# EAGLE design joystick (EAGLE 7.5.0)
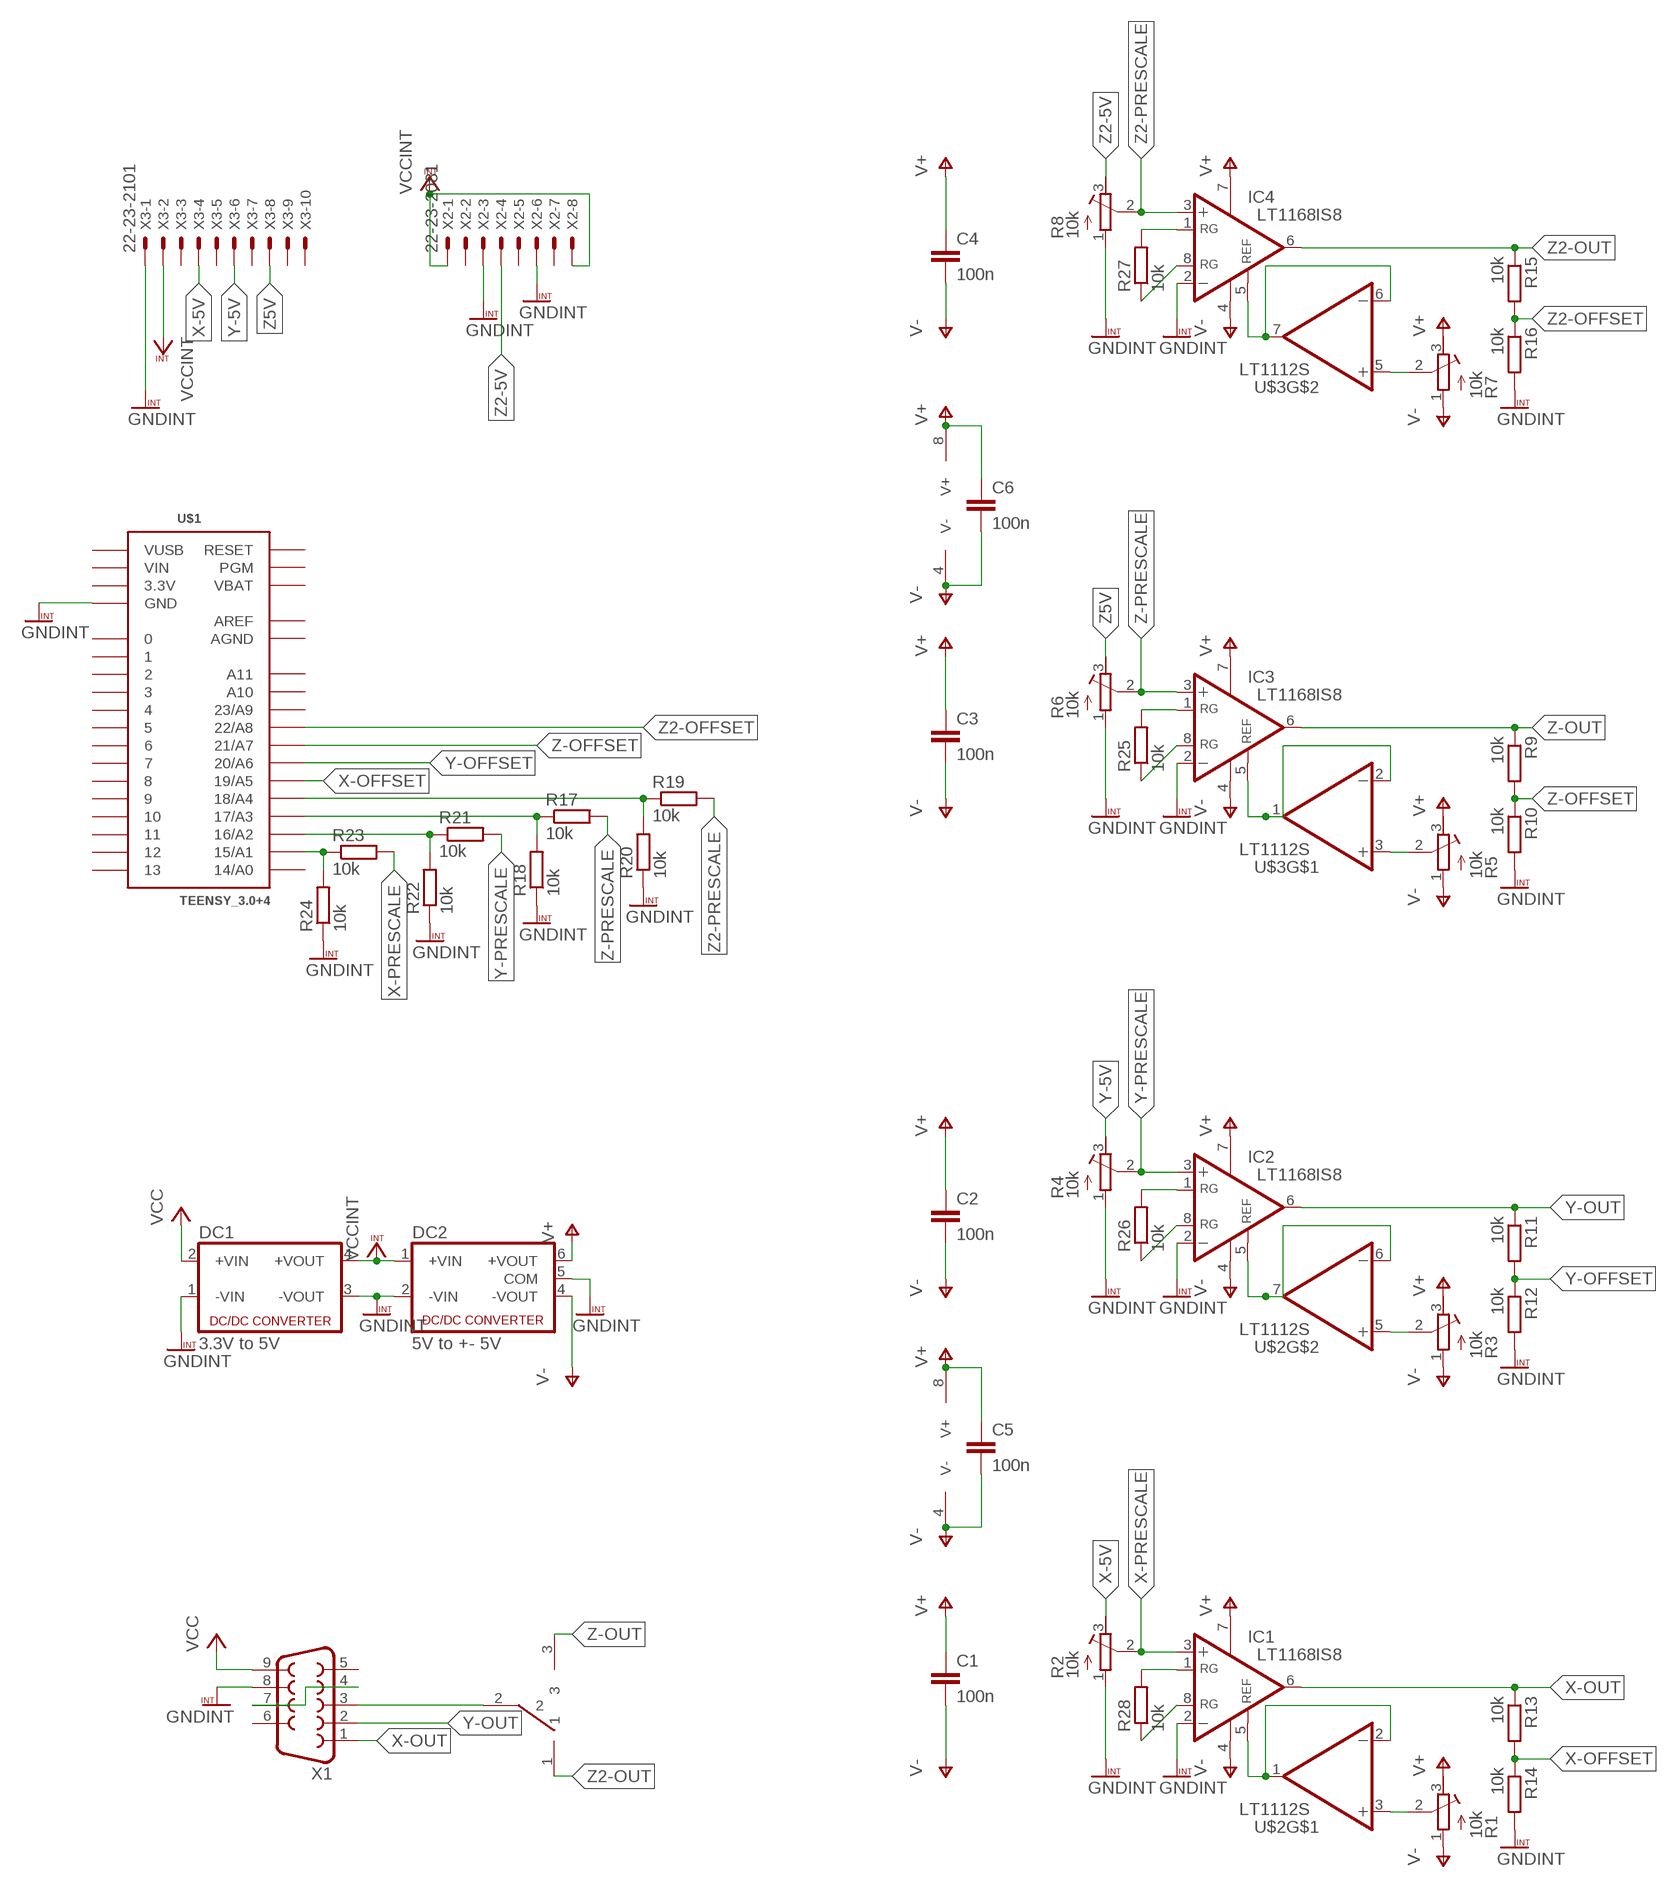
[diagram p0: schematic, sheet 1]

## Parts
C1  100n  C-EUC1206  [C1206]
C2  100n  C-EUC1206  [C1206]
C3  100n  C-EUC1206  [C1206]
C4  100n  C-EUC1206  [C1206]
C5  100n  C-EUC1206  [C1206]
C6  100n  C-EUC1206  [C1206]
DC1  3.3V to 5V  NME  [NME]
DC2  5V to +- 5V  NMA  [NMA]
IC1  LT1168IS8  [SOIC8]
IC2  LT1168IS8  [SOIC8]
IC3  LT1168IS8  [SOIC8]
IC4  LT1168IS8  [SOIC8]
R1  10k  R-TRIMM64W  [RTRIM64W]
R2  10k  R-TRIMM64W  [RTRIM64W]
R3  10k  R-TRIMM64W  [RTRIM64W]
R4  10k  R-TRIMM64W  [RTRIM64W]
R5  10k  R-TRIMM64W  [RTRIM64W]
R6  10k  R-TRIMM64W  [RTRIM64W]
R7  10k  R-TRIMM64W  [RTRIM64W]
R8  10k  R-TRIMM64W  [RTRIM64W]
R9  10k  R-EU_R1206  [R1206]
R10  10k  R-EU_R1206  [R1206]
R11  10k  R-EU_R1206  [R1206]
R12  10k  R-EU_R1206  [R1206]
R13  10k  R-EU_R1206  [R1206]
R14  10k  R-EU_R1206  [R1206]
R15  10k  R-EU_R1206  [R1206]
R16  10k  R-EU_R1206  [R1206]
R17  10k  R-EU_R1206  [R1206]
R18  10k  R-EU_R1206  [R1206]
R19  10k  R-EU_R1206  [R1206]
R20  10k  R-EU_R1206  [R1206]
R21  10k  R-EU_R1206  [R1206]
R22  10k  R-EU_R1206  [R1206]
R23  10k  R-EU_R1206  [R1206]
R24  10k  R-EU_R1206  [R1206]
R25  10k  R-EU_R1206  [R1206]
R26  10k  R-EU_R1206  [R1206]
R27  10k  R-EU_R1206  [R1206]
R28  10k  R-EU_R1206  [R1206]
U$1  TEENSY_3.0+4  [TEENSY_3.0+4]
U$2  LT1112S  [SOIC8]
U$3  LT1112S  [SOIC8]
U$4  MS12ASG40  [MS12ASG40]
X1  F09HP  [F09HP]
X2  22-23-2081  [22-23-2081]
X3  22-23-2101  [22-23-2101]

## Nets
GNDINT: DC1.1(-VIN) DC1.3(-VOUT) DC2.2(-VIN) DC2.5(COM) IC1.2(-IN) IC2.2(-IN) IC3.2(-IN) IC4.2(-IN) R2.1(A) R4.1(A) R6.1(A) R8.1(A) R10.2 R12.2 R14.2 R16.2 R18.1 R20.1 R22.1 R24.1 U$1.GND U$1.GND1(GND) X1.8 X2.3 X2.6 X3.1
N$1: R1.2(S) U$2.3(+IN)
N$4: R3.2(S) U$2.5(+IN)
N$7: R5.2(S) U$3.3(+IN)
N$10: R7.2(S) U$3.5(+IN)
N$13: IC1.5(REF) U$2.1(OUT) U$2.2(-IN)
N$14: IC2.5(REF) U$2.6(-IN) U$2.7(OUT)
N$15: IC3.5(REF) U$3.1(OUT) U$3.2(-IN)
N$16: IC4.5(REF) U$3.6(-IN) U$3.7(OUT)
N$20: X1.4 X1.7
N$26: U$4.2 X1.3
N$27: R17.1 R18.2 U$1.17/A3
N$28: R19.1 R20.2 U$1.18/A4
N$29: R21.1 R22.2 U$1.16/A2
N$30: R23.1 R24.2 U$1.15/A1
N$32: IC1.8(RG) R28.1
N$33: IC1.1(RG) R28.2
N$34: IC2.1(RG) R26.2
N$35: IC2.8(RG) R26.1
N$36: IC3.1(RG) R25.2
N$37: IC3.8(RG) R25.1
N$38: IC4.8(RG) R27.1
N$39: IC4.1(RG) R27.2
V+: C1.1 C2.1 C3.1 C4.1 C5.1 C6.1 DC2.6(+VOUT) IC1.7(V+) IC2.7(V+) IC3.7(V+) IC4.7(V+) R1.3(E) R3.3(E) R5.3(E) R7.3(E) U$2.8(V+) U$3.8(V+)
V-: C1.2 C2.2 C3.2 C4.2 C5.2 C6.2 DC2.4(-VOUT) IC1.4(V-) IC2.4(V-) IC3.4(V-) IC4.4(V-) R1.1(A) R3.1(A) R5.1(A) R7.1(A) U$2.4(V-) U$3.4(V-)
VCC: DC1.2(+VIN) X1.9
VCCINT: DC1.4(+VOUT) DC2.1(+VIN) X2.1 X2.8 X3.2
X-5V: R2.3(E) X3.4
X-OFFSET: R13.2 R14.1 U$1.19/A5
X-OUT: IC1.6(OUT) R13.1 X1.1
X-PRESCALE: IC1.3(+IN) R2.2(S) R23.2
Y-5V: R4.3(E) X3.6
Y-OFFSET: R11.2 R12.1 U$1.20/A6
Y-OUT: IC2.6(OUT) R11.1 X1.2
Y-PRESCALE: IC2.3(+IN) R4.2(S) R21.2
Z2-5V: R8.3(E) X2.4
Z2-OFFSET: R15.2 R16.1 U$1.22/A8
Z2-OUT: IC4.6(OUT) R15.1 U$4.1
Z2-PRESCALE: IC4.3(+IN) R8.2(S) R19.2
Z5V: R6.3(E) X3.8
Z-OFFSET: R9.2 R10.1 U$1.21/A7
Z-OUT: IC3.6(OUT) R9.1 U$4.3
Z-PRESCALE: IC3.3(+IN) R6.2(S) R17.2
Unconnected: U$1.0 U$1.1 U$1.2 U$1.3 U$1.4 U$1.5 U$1.6 U$1.7 U$1.8 U$1.9 U$1.10 U$1.11 U$1.12 U$1.13 U$1.14/A0 U$1.23/A9 U$1.A10 U$1.A11 U$1.PGM U$1.RESET X1.5 X1.6 X2.2 X2.5 X2.7 X3.3 X3.5 X3.7 X3.9 X3.10

## Power pins joined to a net without a drawn wire
3.3V: U$1.3.3V U$1.3.3V1(3.3V)
AGND: U$1.AGND
AREF: U$1.AREF
VBAT: U$1.VBAT
VIN: U$1.VIN
VUSB: U$1.VUSB

## Library data of the parts
C1-C6 = rcl:C-EU: CAPACITOR, European symbol
DC1 = dc-dc-converter:NME: DC-DC CONVERTER; MF: C & D TECHNOLOGIES, INC; MPN: NME1205D; OC_FARNELL: 1021466; OC_NEWARK: 98B8198
DC2 = dc-dc-converter:NMA: DC-DC CONVERTER; MF: C & D TECHNOLOGIES, INC; MPN: NMA0515SC; OC_FARNELL: 1021434; OC_NEWARK: 61K3064
IC1-IC4 = linear-technology:LT1168: Low Power, Single Resistor Gain Programmable, Precision Instrumentation Amplifier SourcE: LT1168.pdf; MPN: LT1168IS8; OC_FARNELL: unknown; OC_NEWARK: 57M2334
R1-R8 = rcl:R-TRIMM: Trimm resistor
R9-R28 = rcl:R-EU_: RESISTOR, European symbol
U$1 = custom:TEENSY_3.0+4: Teensy 3.0 board, showing all pins that are easily acessible. See 'AllAnalogPins" and 'AllPins' packages for additional pin holes, as needed. The 'Basic' package has fewer pins.
U$2 U$3 = custom:LT1112
U$4 = custom:MS12ASG40
X1 = con-subd:F09: SUB-D; OC_FARNELL: unknown; OC_NEWARK: unknown
X2 = con-molex:22-23-2081: .100" (2.54mm) Center Header - 8 Pin; MF: MOLEX; MPN: 22-23-2081; OC_FARNELL: 1756826; OC_NEWARK: 01C7592
X3 = con-molex:22-23-2101: .100" (2.54mm) Center Header - 10 Pin; MF: MOLEX; MPN: 22-23-2101; OC_FARNELL: 1756828; OC_NEWARK: 94C0765

## Board
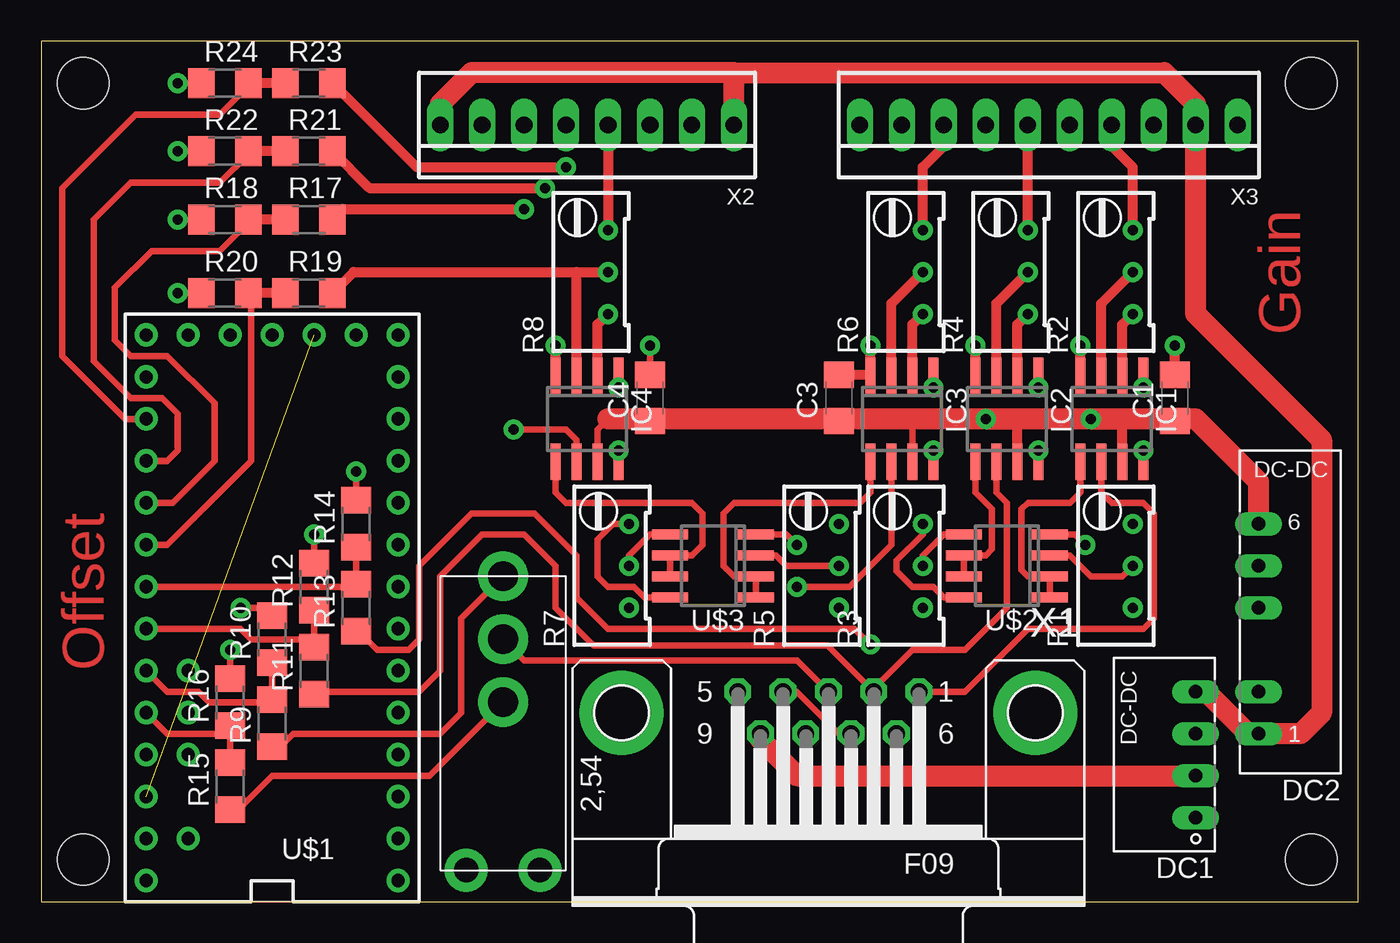
[diagram p1: board, top side]
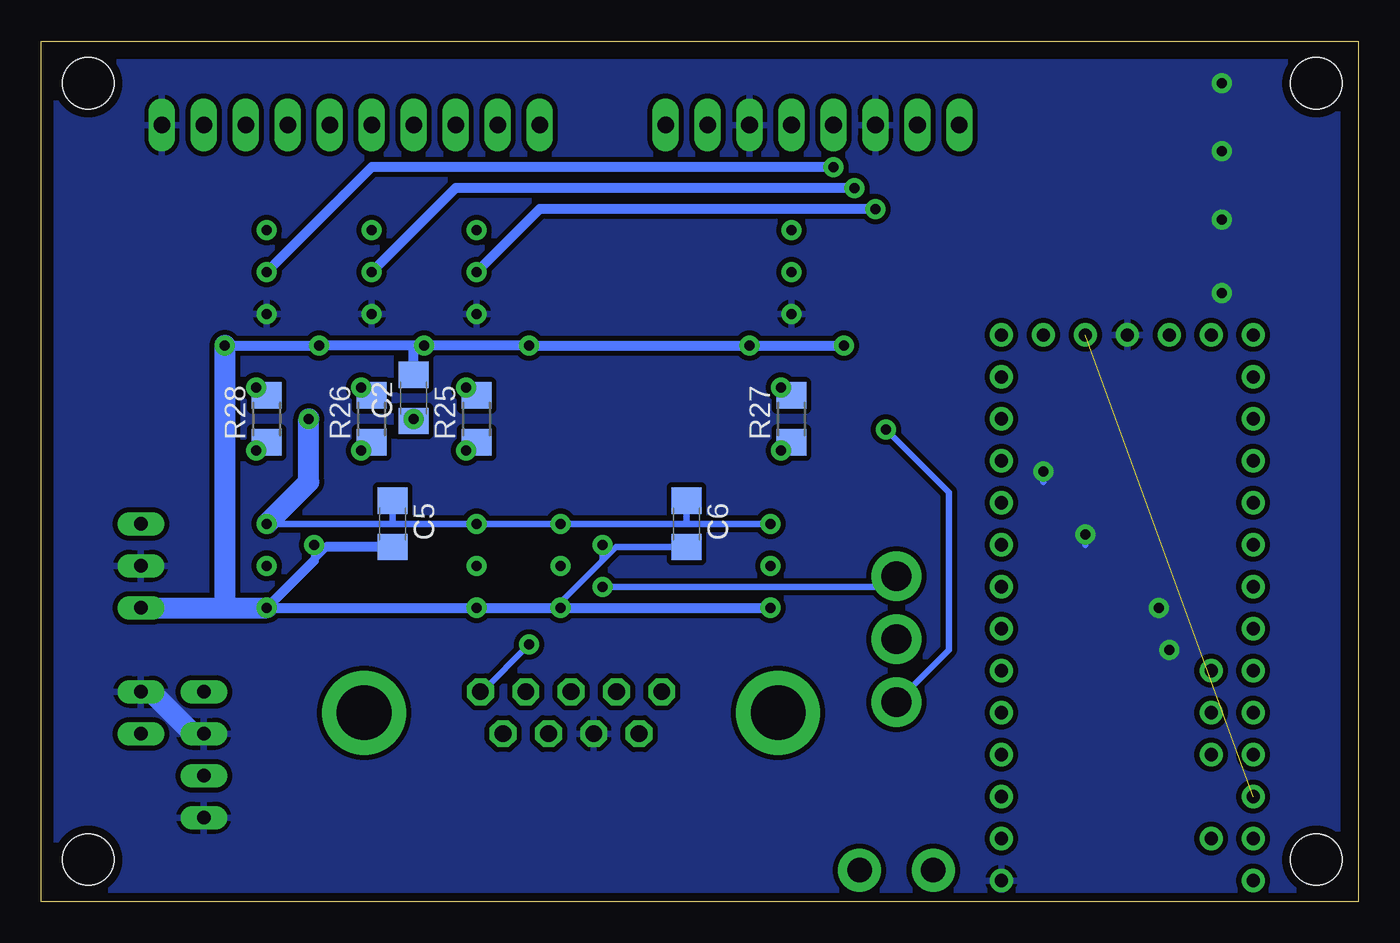
[diagram p2: board, bottom side, seen from below]

Size 79.68 x 52.06 mm. Coordinates in mm from the lower left corner, seen from the top.
Outline: 0,0 79.68,0 79.68,52.06 0,52.06 0,0
Copper layers (1*16): Top 0.035mm / dielectric 1.5mm / Bottom 0.035mm
Design rules "Standard12_lpt *": minimum track width 12mil, minimum drill 16mil, track to track 12mil, track to pad 12mil, pad to pad 12mil, via to via 12mil, smd to smd 0mil, copper to edge 20mil, drill to drill 8mil, minimum pad ring 12mil, minimum via ring 12mil, stop-mask expansion 4mil, vias tented up to drill 0mil, thermal gap 10mil
Holes 3.1 mm at 2.54,49.53 2.54,2.54 76.83,49.53 76.83,2.54

### Footprints (pad centres in the part's own frame; a part is rotated, then mirrored left to right if it is on the bottom)
C1206 = smd 1.6 x 1.8: 1 -1.4,0; 2 1.4,0
NME = drill 0.813 long: 1 0,3.81; 2 0,1.27; 3 0,-1.27; 4 0,-3.81
NMA = drill 0.813 long: 1 0,6.35; 2 0,3.81; 4 0,-1.27; 5 0,-3.81; 6 0,-6.35
SOIC8 = smd 0.6 x 2.2: 1 -1.905,-2.6; 2 -0.635,-2.6; 3 0.635,-2.6; 4 1.905,-2.6; 5 1.905,2.6; 6 0.635,2.6; 7 -0.635,2.6; 8 -1.905,2.6
RTRIM64W = drill 0.61: 1 1.27,-2.54; 2 1.27,0; 3 1.27,2.54
R1206 = smd 1.6 x 1.803: 1 -1.422,0; 2 1.422,0
TEENSY_3.0+4 = drill 0.8: 0 -7.62,13.97; 1 -7.62,11.43; 2 -7.62,8.89; 3 -7.62,6.35; 3.3V 7.62,11.43; 3.3V1 -2.54,-16.51; 4 -7.62,3.81; 5 -7.62,1.27; 6 -7.62,-1.27; 7 -7.62,-3.81; 8 -7.62,-6.35; 9 -7.62,-8.89; 10 -7.62,-11.43; 11 -7.62,-13.97; 12 -7.62,-16.51; 13 7.62,-16.51; 14/A0 7.62,-13.97; 15/A1 7.62,-11.43; 16/A2 7.62,-8.89; 17/A3 7.62,-6.35; 18/A4 7.62,-3.81; 19/A5 7.62,-1.27; 20/A6 7.62,1.27; 21/A7 7.62,3.81; 22/A8 7.62,6.35; 23/A9 7.62,8.89; A10 5.08,6.35; A11 5.08,3.81; AGND 7.62,13.97; AREF 5.08,8.89; GND -7.62,16.51; GND1 0,-16.51; PGM 2.54,-16.51; RESET 5.08,-16.51; VBAT -5.08,-16.51; VIN 7.62,16.51; VUSB 5.08,13.97
MS12ASG40 = drill 1.8 pad 3: 1 0,10.16; 2 0,13.97; 3 0,17.78 | drill 1.5 pad 2.6: P$4 2.225,0; P$5 -2.225,0
F09HP = drill 1.016 octagon: 1 -5.486,-1.27; 2 -2.743,-1.27; 3 0,-1.27; 4 2.743,-1.27; 5 5.486,-1.27; 6 -4.115,1.27; 7 -1.372,1.27; 8 1.372,1.27; 9 4.115,1.27 | drill 3.302 pad 5.08: G1 -12.522,0; G2 12.522,0
22-23-2081 = drill 1 long: 1 -8.89,0; 2 -6.35,0; 3 -3.81,0; 4 -1.27,0; 5 1.27,0; 6 3.81,0; 7 6.35,0; 8 8.89,0
22-23-2101 = drill 1 long: 1 -11.43,0; 2 -8.89,0; 3 -6.35,0; 4 -3.81,0; 5 -1.27,0; 6 1.27,0; 7 3.81,0; 8 6.35,0; 9 8.89,0; 10 11.43,0

### Placement (x,y rotation side)
C1  68.58,30.48 90 top
C2  57.15,30.48 90 bottom
C3  48.26,30.48 90 top
C4  36.83,30.48 90 top
C5  58.42,22.86 270 bottom
C6  40.64,22.86 270 bottom
DC1  69.85,8.89 180 top
DC2  73.66,16.51 180 top
IC1  64.77,29.21 180 top
IC2  58.42,29.21 180 top
IC3  52.07,29.21 180 top
IC4  33.02,29.21 180 top
R1  64.77,20.32 0 top
R2  64.77,38.1 0 top
R3  52.07,20.32 0 top
R4  58.42,38.1 0 top
R5  46.99,20.32 0 top
R6  52.07,38.1 0 top
R7  34.29,20.32 0 top
R8  33.02,38.1 0 top
R9  13.97,10.79 90 top
R10  13.97,15.88 90 top
R11  16.51,13.97 90 top
R12  16.51,19.05 90 top
R13  19.05,17.78 90 top
R14  19.05,22.86 90 top
R15  11.43,6.99 90 top
R16  11.43,12.06 90 top
R17  16.19,41.27 0 top
R18  11.11,41.27 0 top
R19  16.19,36.83 0 top
R20  11.11,36.83 0 top
R21  16.19,45.4 0 top
R22  11.11,45.4 0 top
R23  16.19,49.53 0 top
R24  11.11,49.53 0 top
R25  53.34,29.21 90 bottom
R26  59.69,29.21 90 bottom
R27  34.29,29.21 90 bottom
R28  66.04,29.21 90 bottom
U$1  13.97,17.78 180 top
U$2  58.42,20.32 90 top
U$3  40.64,20.32 90 top
U$4  27.94,1.91 0 top
X1  47.62,11.43 180 top
X2  33.02,46.99 180 top
X3  60.96,46.99 180 top

### Tracks (layer width: path | path; a pad name or v marks a point on that pad's centre or on a via)
3.3V  (1 unrouted)
GNDINT  (via drill 0.6)
  Top 0.406: R14.2 v19.05,26.04 | R12.2 v16.51,22.23 | R10.2 13.82,17.3 13.34,17.78 v12.06,17.78 | R16.2 v11.43,15.24 | R24.1 v8.26,49.53 | R22.1 v8.26,45.4 | R18.1 v8.26,41.27 | R20.1 v8.26,36.83
  Top 0.61: IC3.2 52.7,34.92 R6.1 | IC4.2 33.66,34.92 R8.1 | IC2.2 59.05,34.92 R4.1 | IC1.2 65.41,34.92 R2.1
  Bottom 0.406: v19.05,26.04 19.05,25.4 | 16.51,21.59 v16.51,22.23
  Bottom 1.27: DC1.3 70.48,10.16 73.03,12.7 DC2.2
  pour Bottom: 1.27,50.8 1.27,0 78.74,0 78.74,50.8
N$1
  Top 0.406: U$2.3 62.23,20.95 63.5,19.68 65.41,19.68 R1.2
N$4
  Top 0.406: U$2.5 54.61,22.23 53.34,20.95 R3.2
N$7
  Top 0.406: U$3.3 44.45,20.95 45.09,20.32 R5.2
N$10
  Top 0.406: U$3.5 36.83,22.23 35.56,20.95 R7.2
N$13
  Top 0.406: U$2.1 U$2.2 59.69,19.68 59.31,20.07 59.31,23.75 59.69,24.13 62.23,24.13 62.87,24.77 IC1.5
N$14
  Top 0.406: U$2.7 U$2.6 57.15,20.95 57.53,21.34 57.53,23.75 56.52,24.77 IC2.5
N$15
  Top 0.406: U$3.1 U$3.2 41.91,19.68 41.27,20.32 41.27,23.5 41.91,24.13 49.53,24.13 50.16,24.77 IC3.5
N$16
  Top 0.406: U$3.7 U$3.6 39.37,20.95 40.01,21.59 40.01,23.5 39.37,24.13 31.75,24.13 31.11,24.77 IC4.5
N$20
  Top 0.406: X1.4 45.72,12.7 48.26,10.16 X1.7
N$26
  Top 0.406: X1.3 45.72,14.61 29.21,14.61 U$4.2
N$27
  Top 0.406: 12.09,40.79 12.09,40.66 | U$1.17/A3 7.94,24.13 10.48,26.67 10.48,30.16 7.62,33.02 5.4,33.02 4.45,33.97 4.45,37.15 6.67,39.37 10.79,39.37 12.09,40.66 | R18.2 12.53,41.11 12.09,40.66
  Top 0.61: R17.1 R18.2
N$28
  Top 0.406: U$1.18/A4 7.62,21.59 12.7,26.67 12.7,36.66 R20.2
  Top 0.61: R19.1 R20.2
N$29
  Top 0.406: R22.2 12.53,45.24 10.79,43.5 5.4,43.5 3.17,41.27 3.17,32.7 5.4,30.48 7.3,30.48 8.26,29.53 8.26,27.3 7.62,26.67 U$1.16/A2
  Top 0.61: R21.1 R22.2
N$30
  Top 0.406: R24.2 12.53,49.36 10.79,47.62 5.71,47.62 1.27,43.18 1.27,33.02 5.08,29.21 U$1.15/A1
  Top 0.61: R23.1 R24.2
N$32  (via drill 0.6)
  Top 0.61: IC1.8 v66.67,27.3
  Bottom 0.61: v66.67,27.3 66.52,27.3 R28.1
N$33  (via drill 0.6)
  Top 0.61: IC1.1 v66.67,31.11
  Bottom 0.61: R28.2 66.19,30.63 v66.67,31.11
N$34  (via drill 0.6)
  Top 0.61: IC2.1 v60.33,31.11
  Bottom 0.61: v60.33,31.11 60.17,31.11 R26.2
N$35  (via drill 0.6)
  Top 0.61: IC2.8 v60.33,27.3
  Bottom 0.61: v60.33,27.3 60.17,27.3 R26.1
N$36  (via drill 0.6)
  Top 0.61: IC3.1 v53.98,31.11
  Bottom 0.61: v53.98,31.11 53.82,31.11 R25.2
N$37  (via drill 0.6)
  Top 0.61: IC3.8 v53.98,27.3
  Bottom 0.61: v53.98,27.3 53.82,27.3 R25.1
N$38  (via drill 0.6)
  Top 0.61: IC4.8 v34.92,27.3
  Bottom 0.61: v34.92,27.3 34.77,27.3 R27.1
N$39  (via drill 0.6)
  Top 0.61: IC4.1 v34.92,31.11
  Bottom 0.61: v34.92,31.11 34.77,31.11 R27.2
V+  (via drill 0.6)
  Top 0.406: IC4.7 33.66,28.57 34.29,29.21 | C4.1 36.83,29.21 | C1.1 68.58,29.21 | C3.1 48.26,29.21 | IC3.7 52.7,29.21 | U$3.8 36.51,18.41 35.88,19.05 34.29,19.05 33.66,19.68 33.66,21.91 34.61,22.86 R7.3 | R3.3 53.34,22.23 51.75,20.64 51.75,20 52.7,19.05 53.98,19.05 54.61,18.41 U$2.8
  Top 0.61: IC2.7 59.05,29.21 | IC1.7 65.41,29.21
  Top 1.27: DC2.6 73.66,25.4 69.85,29.21 68.58,29.21 v63.5,29.21 | v63.5,29.21 65.41,29.21 | v63.5,29.21 v57.15,29.21 | v57.15,29.21 59.05,29.21 | v57.15,29.21 52.7,29.21 48.26,29.21 36.83,29.21 34.29,29.21
  Bottom 0.406: R3.3 R5.3 40.64,22.86 | C2.1 57.02,29.08 v57.15,29.21 | 58.42,22.86 R1.3 R3.3 | 58.42,22.86 R3.3 | R7.3 40.64,22.86 | C6.1 40.64,22.86 | C5.1 58.42,22.86
  Bottom 1.27: R1.3 63.5,25.4 v63.5,29.21
V-  (via drill 0.6)
  Top 0.406: U$3.4 45.09,22.23 v45.72,21.59 | 50.09,31.88 IC3.4 | U$2.4 62.55,22.23 v63.18,21.59 | C4.2 v36.83,33.66
  Top 0.61: IC4.4 v31.11,33.66 | C3.2 50.09,31.88 | IC1.4 v62.87,33.66 | IC3.4 v50.16,33.66 | IC2.4 v56.52,33.66 | C1.2 v68.58,33.66
  Bottom 0.406: R5.1 48.26,18.1 45.72,20.64 | 45.72,20.64 v45.72,21.59 | v63.18,21.59 63.18,20.64 62.36,21.46 | C6.2 44.9,21.46 45.72,20.64
  Bottom 0.61: R7.1 R5.1 R3.1 R1.1 63.18,20.64 | v31.11,33.66 v36.83,33.66 v50.16,33.66 v56.52,33.66 57.15,33.66 | 57.15,33.66 v62.87,33.66 v68.58,33.66 | C2.2 57.15,33.66 | C5.2 62.36,21.46
  Bottom 1.27: DC2.4 68.58,17.78 | 68.58,17.78 R1.1 | v68.58,33.66 68.58,17.78
VCC
  Top 1.27: X1.9 43.51,9.83 45.72,7.62 DC1.2
VCCINT
  Top 1.27: 41.91,50.16 26.04,50.16 24.13,48.26 X2.8 | X2.1 41.91,50.16 | 41.91,50.16 67.94,50.16 69.85,48.26 X3.2 69.85,35.56 77.47,27.94 77.47,11.43 76.2,10.16 DC2.1 73.03,10.16 70.48,12.7 DC1.4
X-5V
  Top 0.61: R2.3 66.04,44.45 64.77,45.72 X3.4
X-OFFSET
  Top 0.406: U$1.19/A5 18.9,19.05 R13.2 R14.1
X-OUT  (via drill 0.6)
  Top 0.406: X1.1 55.88,12.7 59.69,16.51 66.67,16.51 67.31,17.14 67.31,23.5 66.67,24.13 64.77,24.13 64.14,24.77 IC1.6 | R13.1 19.2,16.36 20.32,15.24 22.23,15.24 22.86,15.88 22.86,20.32 26.04,23.5 29.84,23.5 32.38,20.95 32.38,18.41 34.29,16.51 49.21,16.51 v50.16,15.56
  Bottom 0.406: X1.1 53.02,12.7 v50.16,15.56
X-PRESCALE  (via drill 0.6)
  Top 0.61: IC1.3 64.14,36.2 R2.2 | v31.75,44.45 22.7,44.45 R23.2
  Bottom 0.61: v31.75,44.45 59.69,44.45 R2.2
Y-5V
  Top 0.61: R4.3 X3.6
Y-OFFSET
  Top 0.406: U$1.20/A6 12.06,16.51 12.7,15.88 16.03,15.88 R11.2 R12.1
Y-OUT
  Top 0.406: IC2.6 57.78,24.77 58.42,24.13 58.42,17.78 55.88,15.24 52.7,15.24 50.37,12.9 X1.2 47.57,15.49 33.4,15.49 31.11,17.78 31.11,20.32 29.21,22.23 26.67,22.23 24.13,19.68 24.13,13.97 22.86,12.7 16.51,12.7 16.36,12.55 R11.1
Y-PRESCALE  (via drill 0.6)
  Top 0.61: IC2.3 57.78,36.2 R4.2 | v30.48,43.18 19.84,43.18 R21.2
  Bottom 0.61: v30.48,43.18 54.61,43.18 R4.2
Z2-5V
  Top 0.61: X2.4 R8.3
Z2-OFFSET
  Top 0.406: U$1.22/A8 7.62,10.16 10.95,10.16 R16.1 R15.2
Z2-OUT  (via drill 0.6)
  Top 0.406: R15.1 11.91,5.56 13.97,7.62 23.5,7.62 U$4.1 | v28.57,28.57 31.75,28.57 32.38,27.94 IC4.6
  Bottom 0.406: U$4.1 24.77,15.24 24.77,24.77 v28.57,28.57
Z2-PRESCALE
  Top 0.61: IC4.3 32.38,36.2 32.38,38.1 | 32.38,38.1 18.88,38.1 R19.2 | 32.38,38.1 R8.2
Z5V
  Top 0.61: R6.3 53.34,44.45 54.61,45.72 X3.8
Z-OFFSET
  Top 0.406: U$1.21/A7 7.62,12.7 9.53,12.7 10.16,12.06 13.82,12.06 R9.2 R10.1
Z-OUT  (via drill 0.6)
  Top 0.406: R9.1 14.45,9.37 15.24,10.16 24.13,10.16 25.4,11.43 25.4,17.14 U$4.3 | IC3.6 51.44,21.59 48.9,19.05 v45.72,19.05
  Bottom 0.406: U$4.3 28.57,19.05 v45.72,19.05
Z-PRESCALE  (via drill 0.6)
  Top 0.61: IC3.3 51.44,36.2 R6.2 | v29.21,41.91 18.25,41.91 R17.2
  Bottom 0.61: v29.21,41.91 49.53,41.91 R6.2

### Text on the board
Top: Gain | Offset